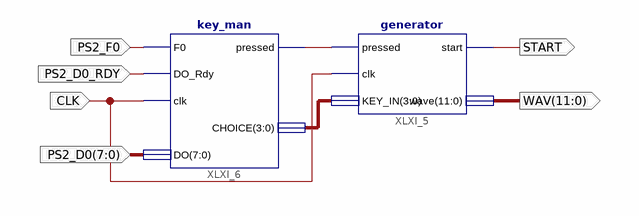
[diagram p0: schematic sheet 1]
// Xilinx ISE schematic scheme.sch (spartan6) as structural Verilog: 2 symbols, 6 ports
module scheme (
  input  CLK,
  input  PS2_D0_RDY,
  input  PS2_F0,
  input  [7:0] PS2_D0,
  output START,
  output [11:0] WAV
);

  wire XLXN_10;
  wire [3:0] XLXN_11;

  generator XLXI_5 (.pressed(XLXN_10), .clk(CLK), .KEY_IN(XLXN_11), .start(START), .wave(WAV));
  key_man XLXI_6 (.F0(PS2_F0), .DO_Rdy(PS2_D0_RDY), .clk(CLK), .DO(PS2_D0), .pressed(XLXN_10), .CHOICE(XLXN_11));
endmodule
